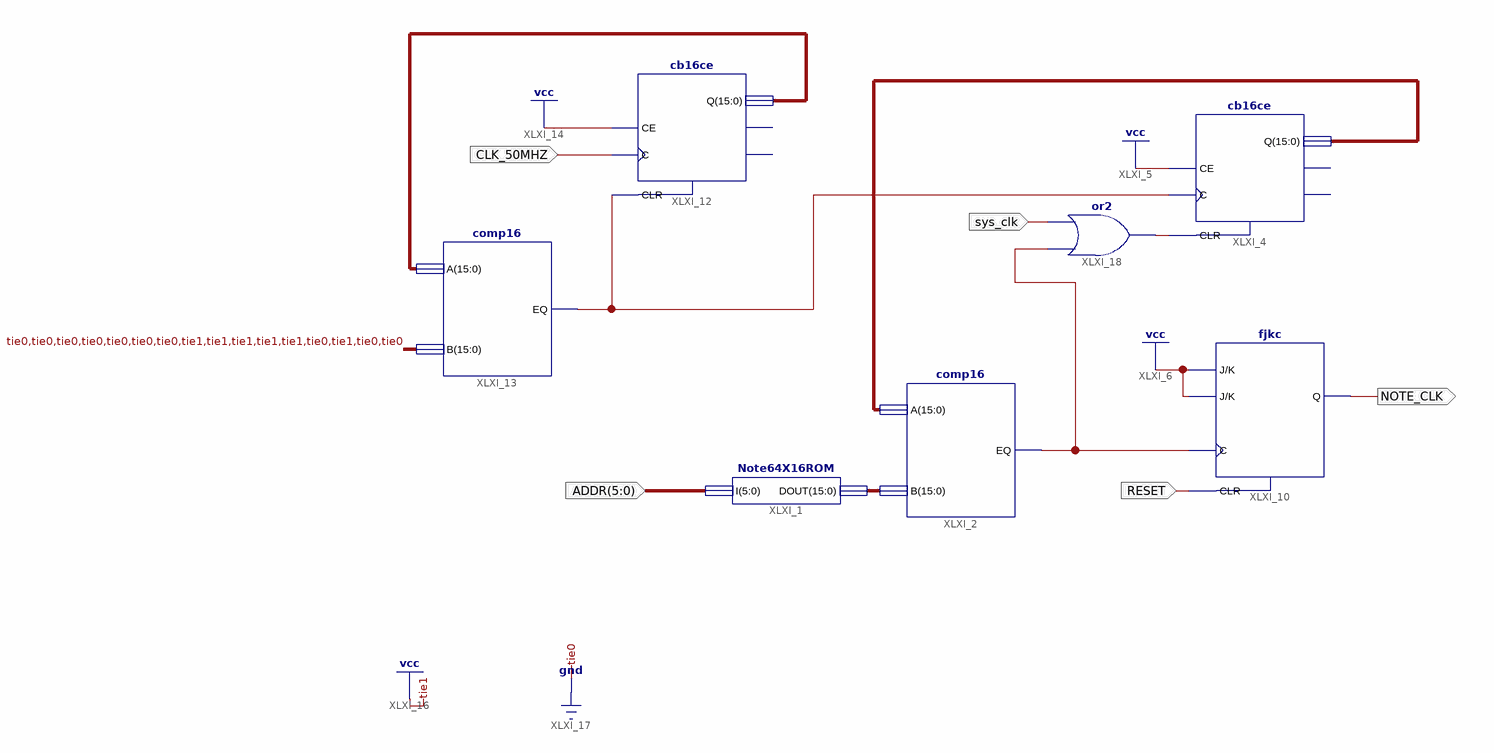
[diagram p0: schematic sheet 1]
// Xilinx ISE schematic Note_CLK_GEN2.sch (spartan6) as structural Verilog: 7 symbols, 5 ports
module Note_CLK_GEN2 (
  input  [5:0] ADDR,
  input  RESET,
  input  sys_clk,
  input  CLK_50MHZ,
  output NOTE_CLK
);

  wire CLK_50KHZ, XLXN_38, XLXN_39;
  wire [15:0] XLXN_1, XLXN_9, XLXN_30;

  Note64X16ROM XLXI_1 (.I(ADDR), .DOUT(XLXN_1));
  comp16 XLXI_2 (.A(XLXN_9), .B(XLXN_1), .EQ(XLXN_39));
  cb16ce XLXI_4 (.C(CLK_50KHZ), .CE(1'b1), .CLR(XLXN_38), .Q(XLXN_9));  // open: CEO, TC
  fjkc XLXI_10 (.C(XLXN_39), .CLR(RESET), .J(1'b1), .K(1'b1), .Q(NOTE_CLK));
  cb16ce XLXI_12 (.C(CLK_50MHZ), .CE(1'b1), .CLR(CLK_50KHZ), .Q(XLXN_30));  // open: CEO, TC
  comp16 XLXI_13 (.A(XLXN_30), .B(16'b0000000111110100), .EQ(CLK_50KHZ));
  or XLXI_18 (XLXN_38, XLXN_39, sys_clk);
endmodule
